# Altium schematic sheet [07] - LED, CONFIG, & BUTTON.SchDoc
size A2; DocumentNumber: 7; SheetNumber: 7; SheetTotal: 13; NameAuthor: Angle Vu
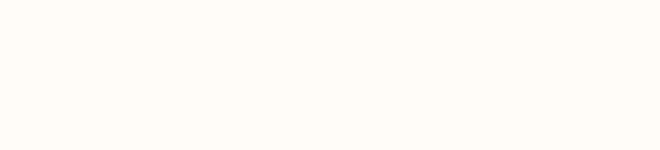
[diagram p0: [07] - LED, CONFIG, & BUTTON.SchDoc]

## Notes on the sheet
- CLOCKS (CPU & PCIE)
- Designed By
- Checked By
- Page Name:
- Size:
- A2
- Company:
- Address:
- Sheet:
- /